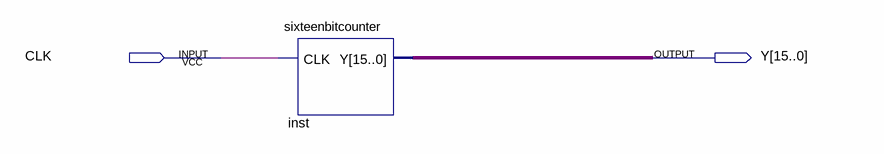
[diagram p0: schematic sheet]
// Quartus schematic behavioural.bdf as structural Verilog: 1 symbols, 2 pins
module behavioural (
  input  CLK,
  output [15:0] Y
);

  sixteenbitcounter inst (.CLK(CLK), .Y(Y));
endmodule
